# EAGLE schematic v1-1-0b (EAGLE 9.6.2)
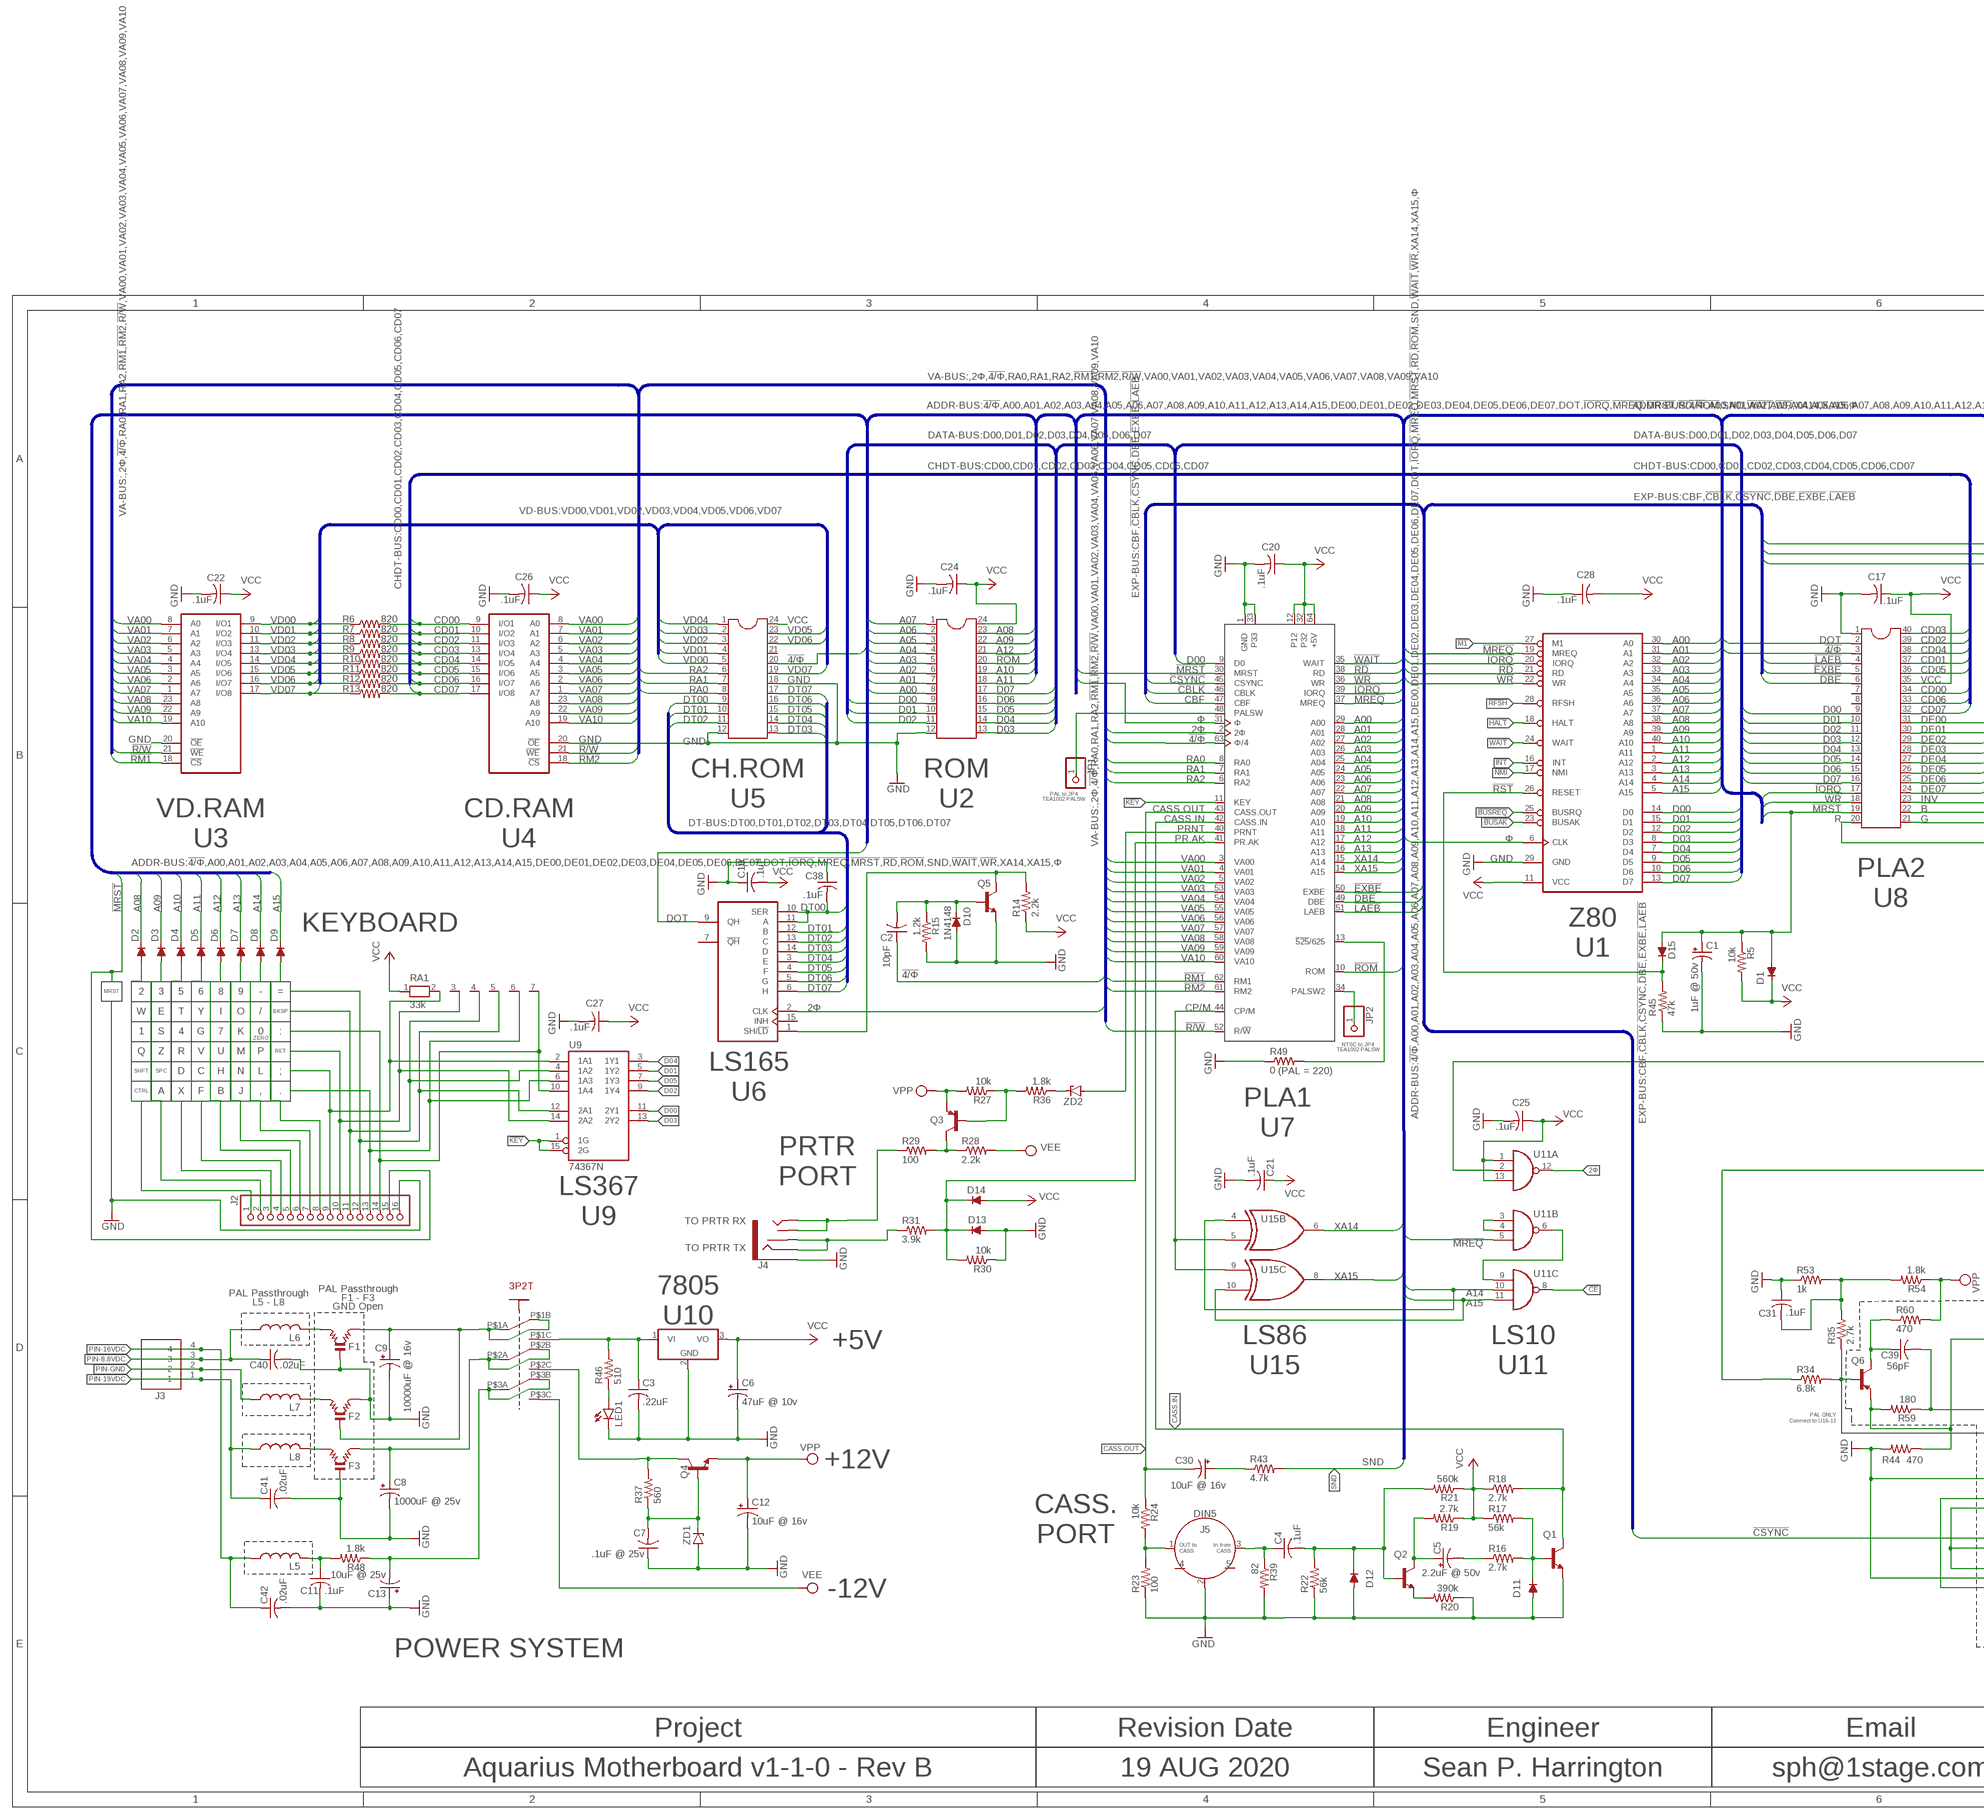
[diagram p0: schematic, sheet 1, part 1 of 2]
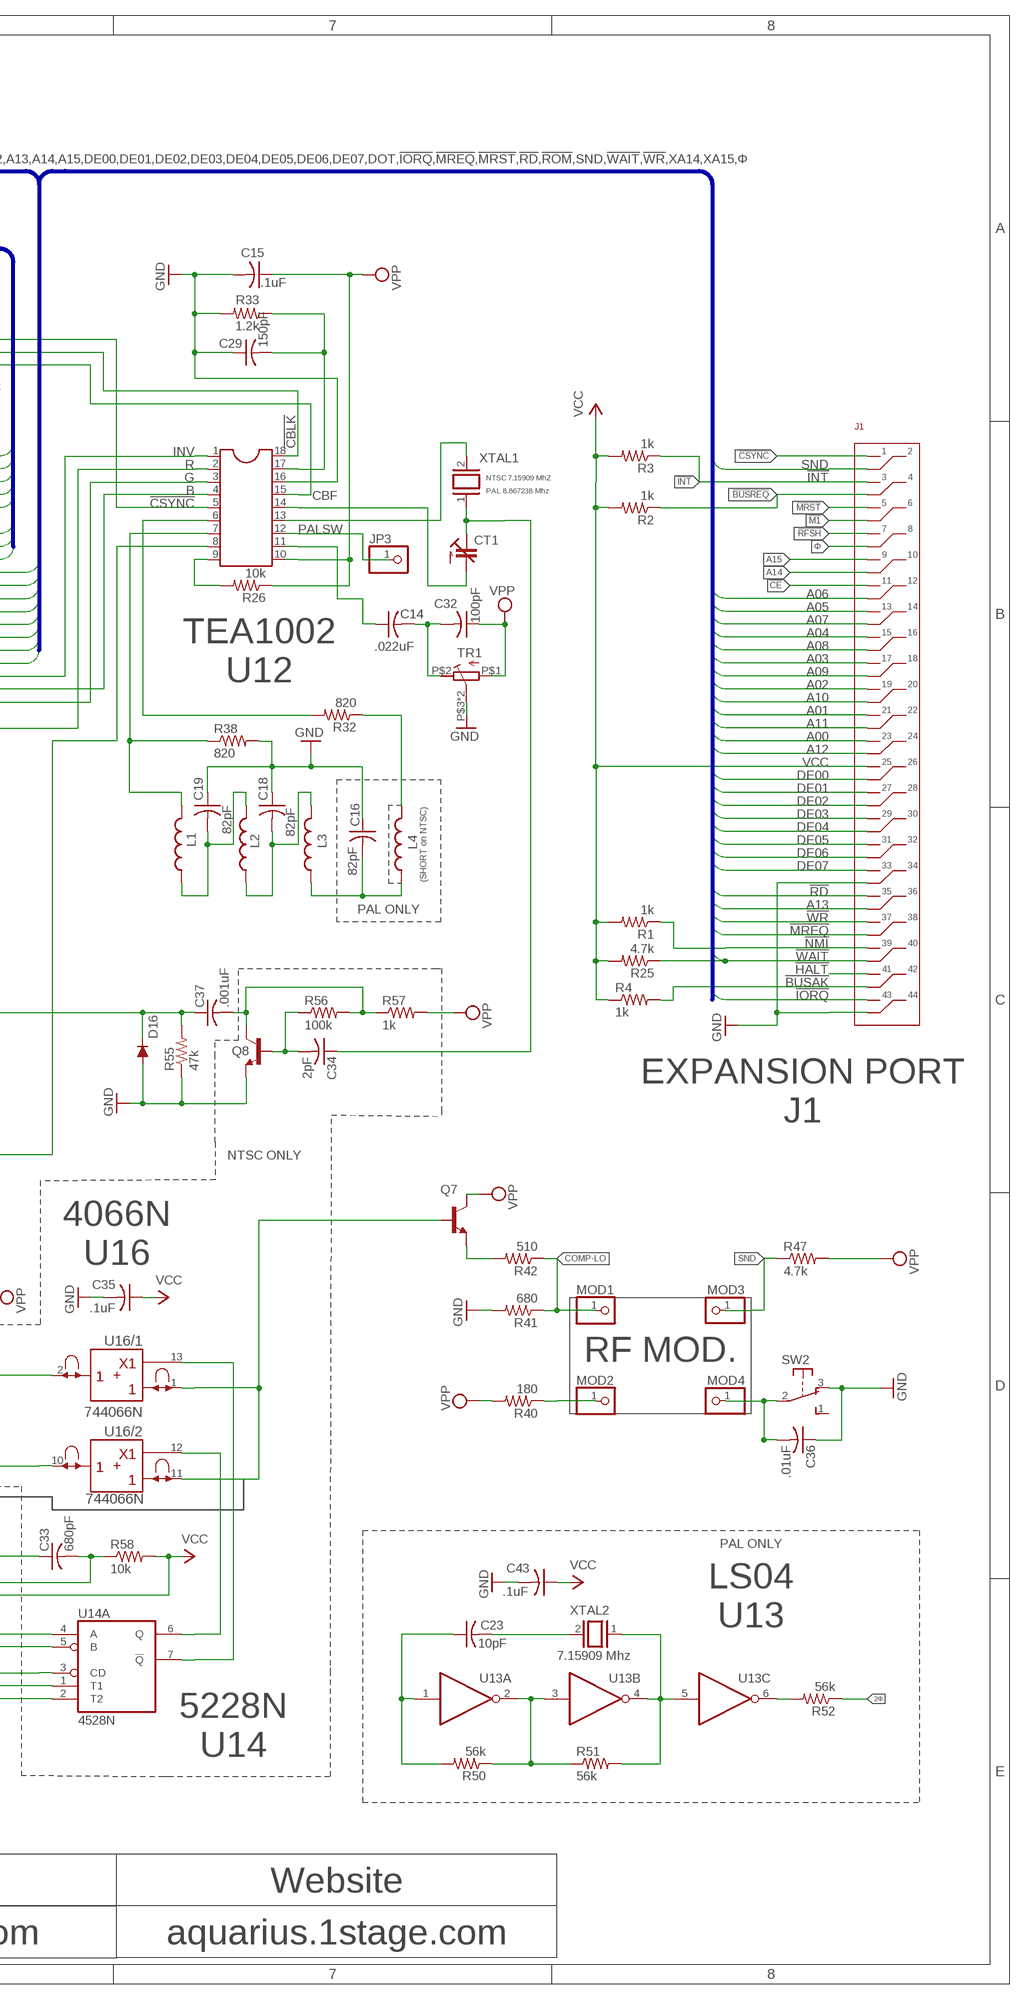
[diagram p1: schematic, sheet 1, part 2 of 2]

## Parts
C1  1uF @ 50v  CPOL-USE2.5-6  [E2,5-6]
C2  10pF  C-US050-024X044  [C050-024X044]
C3  .22uF  C-US050-025X090  [C050-025X090]
C4  .1uF  C-US050-025X090  [C050-025X090]
C5  2.2uF @ 50v  CPOL-USE2.5-6  [E2,5-6]
C6  47uF @ 10v  CPOL-USE2.5-6  [E2,5-6]
C7  .1uF @ 25v  C-US050-025X090  [C050-025X090]
C8  1000uF @ 25v  CPOL-USE7.5-16  [E7,5-16]
C9  10000uF @ 16v  CPOL-USE45-18AXIAL  [E45-18]
C10  .1uF  C-US050-025X090  [C050-025X090]
C11  .1uF  C-US050-025X090  [C050-025X090]
C12  10uF @ 16v  CPOL-USE2.5-6  [E2,5-6]
C13  10uF @ 25v  CPOL-USE2.5-6  [E2,5-6]
C14  .022uF  C-US050-024X044  [C050-024X044]
C15  .1uF  C-US050-025X090  [C050-025X090]
C16  82pF  C-US050-024X044  [C050-024X044]
C17  .1uF  C-US050-025X090  [C050-025X090]
C18  82pF  C-US050-024X044  [C050-024X044]
C19  82pF  C-US050-024X044  [C050-024X044]
C20  .1uF  C-US050-025X090  [C050-025X090]
C21  .1uF  C-US050-025X090  [C050-025X090]
C22  .1uF  C-US050-025X085  [C050-025X085]
C23  10pF  C-US050-024X044  [C050-024X044]
C24  .1uF  C-US050-025X090  [C050-025X090]
C25  .1uF  C-US050-025X090  [C050-025X090]
C26  .1uF  C-US050-025X085  [C050-025X085]
C27  .1uF  C-US050-025X090  [C050-025X090]
C28  .1uF  C-US050-025X090  [C050-025X090]
C29  150pF  C-US050-024X044  [C050-024X044]
C30  10uF @ 16v  CPOL-USE2.5-6  [E2,5-6]
C31  .1uF  C-US050-024X044  [C050-024X044]
C32  100pF  C-US025-024X044  [C025-024X044]
C33  680pF  C-US050-024X044  [C050-024X044]
C34  2pF  C-US025-024X044  [C025-024X044]
C35  .1uF  C-US050-025X090  [C050-025X090]
C36  .01uF  C-US050-024X044  [C050-024X044]
C37  .001uF  C-US025-030X050  [C025-030X050]
C38  .1uF  C-US050-025X085  [C050-025X085]
C39  56pF  C-US050-024X044  [C050-024X044]
C40  .02uF  C-US050-025X090  [C050-025X090]
C41  .02uF  C-US050-025X090  [C050-025X090]
C42  .02uF  C-US050-025X090  [C050-025X090]
C43  .1uF  C-US050-025X090  [C050-025X090]
CT1  C-TRIMM808  [CTRIM808-BC]
D1  1N4148  [DO35-10]
D2  1N4148H  1N4148-12  [DO35-12]
D3  1N4148H  1N4148-12  [DO35-12]
D4  1N4148H  1N4148-12  [DO35-12]
D5  1N4148H  1N4148-12  [DO35-12]
D6  1N4148H  1N4148-12  [DO35-12]
D7  1N4148H  1N4148-12  [DO35-12]
D8  1N4148H  1N4148-12  [DO35-12]
D9  1N4148H  1N4148-12  [DO35-12]
D10  1N4148  [DO35-10]
D11  1N4148  [DO35-10]
D12  1N4148  [DO35-10]
D13  1N4148  [DO35-10]
D14  1N4148  [DO35-10]
D15  1N4148  [DO35-10]
D16  1N4148  [DO35-10]
F1  LCL  [LCL]
F2  LCL  [LCL]
F3  LCL  [LCL]
J1  CR22A-44D-2.54DSA(70)  [CR22A-44D-2.54DSA(70)]
J2  PINHD-1X16  [1X16]
J3  26-60-4040  [SHDR4W155P0X396_1X4_1570X1001X]
J4  AUDIO_JACK_3.5MM_PTH  [AUDIO-JACK]
J5  DIN5  [DIN5-RA-PTH]
JP1  PINHD-1X1  [1X01]
JP2  PINHD-1X1  [1X01]
JP3  PINHD-1X1  [1X01]
L1  L-USTFI0305  [TFI0305]
L2  L-USTFI0305  [TFI0305]
L3  L-USTFI0305  [TFI0305]
L4  L-USTFI0305  [TFI0305]
L5  L-USTFI0305  [TFI0305]
L6  L-USTFI0305  [TFI0305]
L7  L-USTFI0305  [TFI0305]
L8  L-USTFI0305  [TFI0305]
LED1  LED5MM  [LED5MM]
MOD1  PINHD-1X1  [1X01]
MOD2  PINHD-1X1  [1X01]
MOD3  PINHD-1X1  [1X01]
MOD4  PINHD-1X1  [1X01]
Q1  -NPN-TO92-E1  [TO92-E1]
Q2  -NPN-TO92-E1  [TO92-E1]
Q3  -PNP-TO92-E1  [TO92-E1]
Q4  -NPN-TO220V  [TO220V]
Q5  -NPN-TO92-E1  [TO92-E1]
Q6  -PNP-TO92-E1  [TO92-E1]
Q7  -NPN-TO92-E1  [TO92-E1]
Q8  -NPN-TO92-E1  [TO92-E1]
R1  1k  R-US_0207/10  [0207/10]
R2  1k  R-US_0207/10  [0207/10]
R3  1k  R-US_0207/10  [0207/10]
R4  1k  R-US_0207/10  [0207/10]
R5  10k  R-US_0207/10  [0207/10]
R6  820  R-US_0207/10  [0207/10]
R7  820  R-US_0207/10  [0207/10]
R8  820  R-US_0207/10  [0207/10]
R9  820  R-US_0207/10  [0207/10]
R10  820  R-US_0207/10  [0207/10]
R11  820  R-US_0207/10  [0207/10]
R12  820  R-US_0207/10  [0207/10]
R13  820  R-US_0207/10  [0207/10]
R14  2.2k  R-US_0207/10  [0207/10]
R15  1.2k  R-US_0207/10  [0207/10]
R16  2.7k  R-US_0207/10  [0207/10]
R17  56k  R-US_0207/10  [0207/10]
R18  2.7k  R-US_0207/10  [0207/10]
R19  2.7k  R-US_0207/10  [0207/10]
R20  390k  R-US_0207/10  [0207/10]
R21  560k  R-US_0207/10  [0207/10]
R22  56k  R-US_0207/10  [0207/10]
R23  100  R-US_0207/10  [0207/10]
R24  10k  R-US_0207/10  [0207/10]
R25  4.7k  R-US_0207/10  [0207/10]
R26  10k  R-US_0207/10  [0207/10]
R27  10k  R-US_0207/10  [0207/10]
R28  2.2k  R-US_0207/10  [0207/10]
R29  100  R-US_0207/10  [0207/10]
R30  10k  R-US_0207/10  [0207/10]
R31  3.9k  R-US_0207/10  [0207/10]
R32  820  R-US_0207/10  [0207/10]
R33  1.2k  R-US_0207/10  [0207/10]
R34  6.8k  R-US_0207/10  [0207/10]
R35  2.7k  R-US_0207/10  [0207/10]
R36  1.8k  R-US_0207/10  [0207/10]
R37  560  R-US_0207/10  [0207/10]
R38  820  R-US_0207/10  [0207/10]
R39  82  R-US_0207/10  [0207/10]
R40  180  R-US_0207/10  [0207/10]
R41  680  R-US_0207/10  [0207/10]
R42  510  R-US_0207/10  [0207/10]
R43  4.7k  R-US_0207/10  [0207/10]
R44  470  R-US_0207/10  [0207/10]
R45  47k  R-US_0207/10  [0207/10]
R46  510  R-US_0207/10  [0207/10]
R47  4.7k  R-US_0207/10  [0207/10]
R48  1.8k  R-US_0207/10  [0207/10]
R49  0  R-US_0207/7  [0207/7]
R50  56k  R-US_0207/10  [0207/10]
R51  56k  R-US_0207/10  [0207/10]
R52  56k  R-US_0207/10  [0207/10]
R53  1k  R-US_0207/10  [0207/10]
R54  1.8k  R-US_0207/10  [0207/10]
R55  47k  R-US_0207/10  [0207/10]
R56  100k  R-US_0207/10  [0207/10]
R57  1k  R-US_0207/10  [0207/10]
R58  10k  R-US_0207/10  [0207/10]
R59  180  R-US_0207/10  [0207/10]
R60  470  R-US_0207/10  [0207/10]
RA1  33k  RN06  [RN-7]
SW1  3PDT-AQ-SWITCH  [3PDT-AQ-SWITCH]
SW2  9077-1  [9077-1]
TR1  R-TRIMM10MM-DUAL  [10MM-DUAL]
U1  Z80CPU  [DIL40]
U2  DIL24-6  [DIL24-6]
U3  6116P  [DIL24-6]
U4  6116P  [DIL24-6]
U5  DIL24-6  [DIL24-6]
U6  74LS165N  [DIL16]
U7  HD61K202P-PLA1  [HD61K202P-PLA1]
U8  DIL40  [DIL40]
U9  74367N  [DIL16]
U10  7805  7805TV  [TO220V]
U11  74LS10N  [DIL14]
U12  DIL18  [DIL18]
U13  74LS04N  [DIL14]
U14  4528N  [DIL16]
U15  74LS86N  [DIL14]
U16  744066N  [DIL14]
XTAL1  7.15909 MhZ  XTAL  [Q]
XTAL2  7.15909 Mhz  XTAL  [Q]
ZD1  ZENER-DIODEZD-10  [ZDIO-10]
ZD2  ZENER-DIODEZD-7.5  [ZDIO-7.5]

## Nets
2Φ: R52.1 U6.2(CLK) U7.2(2Φ) U11.12(A:O)
!4/Φ: C2.1 U5.20 U7.63(Φ/4) U8.3
!BUSAK: J1.P$42(X42) R4.2 U1.23(BUSAK)
!BUSREQ: J1.P$4(X4) R2.1 U1.25(BUSRQ)
!CBLK: U7.46(CBLK) U12.18
!CE: J1.P$11(X11) U11.8(C:O)
!CSYNC: J1.P$1(X1) U7.45(CSYNC) U12.5 U14.4(A:A)
!DBE: U7.49(DBE) U8.6
!EXBE: U7.50(EXBE) U8.5
!HALT: J1.P$41(X41) U1.18(HALT)
!INT: J1.P$3(X3) R3.1 U1.16(INT)
!IORQ: J1.P$43(X43) U1.20(IORQ) U7.39(IORQ) U8.17
!KEY: U7.11(KEY) U9.1(1G) U9.15(2G)
!LAEB: U7.51(LAEB) U8.4
!M1: J1.P$6(X6) U1.27(M1)
!MREQ: J1.P$38(X38) U1.19(MREQ) U7.37(MREQ) U11.5(B:I2)
!MRST: C1.+ D1.A D15.A J1.P$5(X5) J2.15 R5.1 U7.30(MRST) U8.19
!NMI: J1.P$39(X39) R1.1 U1.17(NMI)
!PL: Q5.1(C) R14.2 U6.1(SH/!LD)
!R/W: U3.21(!WE) U4.21(!WE) U7.52(R/!W)
!RD: J1.P$35(X35) U1.21(RD) U7.38(RD)
!RFSH: J1.P$7(X7) U1.28(RFSH)
!RM1: U3.18(!CS) U7.62(RM1)
!RM2: U4.18(!CS) U7.61(RM2)
!ROM: U2.20 U7.10(ROM)
!RST: D15.C R45.2 U1.26(RESET)
!WAIT: J1.P$40(X40) R25.1 U1.24(WAIT) U7.35(WAIT)
!WR: J1.P$37(X37) U1.22(WR) U7.36(WR) U8.18
A00: J1.P$23(X23) U1.30(A0) U2.8 U7.29(A00)
A01: J1.P$21(X21) U1.31(A1) U2.7 U7.28(A01)
A02: J1.P$19(X19) U1.32(A2) U2.6 U7.27(A02)
A03: J1.P$17(X17) U1.33(A3) U2.5 U7.26(A03)
A04: J1.P$15(X15) U1.34(A4) U2.4 U7.25(A04)
A05: J1.P$13(X13) U1.35(A5) U2.3 U7.24(A05)
A06: J1.P$12(X12) U1.36(A6) U2.2 U7.23(A06)
A07: J1.P$14(X14) U1.37(A7) U2.1 U7.22(A07)
A08: D2.C J1.P$16(X16) U1.38(A8) U2.23 U7.21(A08)
A09: D3.C J1.P$18(X18) U1.39(A9) U2.22 U7.20(A09)
A10: D4.C J1.P$20(X20) U1.40(A10) U2.19 U7.19(A10)
A11: D5.C J1.P$22(X22) U1.1(A11) U2.18 U7.18(A11)
A12: D6.C J1.P$24(X24) U1.2(A12) U2.21 U7.17(A12)
A13: D7.C J1.P$36(X36) U1.3(A13) U7.16(A13)
A14: D8.C J1.P$10(X10) U1.4(A14) U11.10(C:I1) U15.4(B:I0)
A15: D9.C J1.P$9(X9) U1.5(A15) U11.11(C:I2) U15.10(C:I1)
B: U8.22 U12.4
CASS.IN: Q1.1(C) R18.2 U7.42(CASS.IN)
CASS.OUT: C30.- R24.1 U7.43(CASS.OUT)
CBF: U7.47(CBF) U12.15
CD00: R6.2 U4.9(I/O1) U8.34
CD01: R7.2 U4.10(I/O2) U8.37
CD02: R8.2 U4.11(I/O3) U8.39
CD03: R9.2 U4.13(I/O4) U8.40
CD04: R10.2 U4.14(I/O5) U8.38
CD05: R11.2 U4.15(I/O6) U8.36
CD06: R12.2 U4.16(I/O7) U8.33
CD07: R13.2 U4.17(I/O8) U8.32
COMP-LO: MOD1.1 R41.1 R42.1
CP/M: U7.44(CP/M) U15.5(B:I1) U15.9(C:I0)
D00: U1.14(D0) U2.9 U7.9(D0) U8.9 U9.11(2Y1)
D01: U1.15(D1) U2.10 U8.10 U9.5(1Y2)
D02: U1.12(D2) U2.11 U8.11 U9.9(1Y4)
D03: U1.8(D3) U2.13 U8.12 U9.13(2Y2)
D04: U1.7(D4) U2.14 U8.13 U9.3(1Y1)
D05: U1.9(D5) U2.15 U8.14 U9.7(1Y3)
D06: U1.10(D6) U2.16 U8.15
D07: U1.13(D7) U2.17 U8.16
DE00: J1.P$26(X26) U8.31
DE01: J1.P$27(X27) U8.30
DE02: J1.P$28(X28) U8.29
DE03: J1.P$29(X29) U8.28
DE04: J1.P$30(X30) U8.27
DE05: J1.P$31(X31) U8.26
DE06: J1.P$32(X32) U8.25
DE07: J1.P$33(X33) U8.24
DOT: U6.9(QH) U8.2
DT00: C38.2 U5.9 U6.10(SER) U6.11(A)
DT01: U5.10 U6.12(B)
DT02: U5.11 U6.13(C)
DT03: U5.13 U6.14(D)
DT04: U5.14 U6.3(E)
DT05: U5.15 U6.4(F)
DT06: U5.16 U6.5(G)
DT07: U5.17 U6.6(H)
G: U8.21 U12.3
GND: C1.- C3.2 C6.- C7.1 C8.- C9.- C10.1 C11.2 C12.- C13.+ C15.2 C16.1 C17.2 C18.1 C19.1 C20.2 C21.2 C22.2 C24.2 C25.2 C26.2 C27.2 C28.1 C29.1 C31.1 C33.1 C35.2 C36.1 C38.1 C40.2 C41.2 C42.2 C43.2 D10.A D11.A D12.A D13.A D16.A F1.0(GND) F2.2 F3.0(GND) J1.P$34(X34) J1.P$44(X44) J2.16 J4.SLEEVE J5.2 LED1.K(C) Q1.3(E) Q5.3(E) Q8.3(E) R15.2 R20.1 R22.1 R23.1 R30.1 R33.2 R38.2 R39.2 R41.2 R44.2 R45.1 R49.1 R53.1 R55.1 SW2.3(O) TR1.P$3(S) TR1.P$4(S) U1.29(GND) U2.12 U3.20(!OE) U4.20(!OE) U5.12 U5.18 U7.1(GND) U7.33 U8.1 U10.2(GND) U12.16 U14.1(A:T1) ZD1.A
INV: U8.23 U12.1
KH01: D2.A J2.1
KH02: D3.A J2.2
KH03: D4.A J2.3
KH04: D5.A J2.4
KH05: D6.A J2.5
KH06: D7.A J2.6
KH07: D8.A J2.7
KH08: D9.A J2.8
KH09: J2.9 RA1.2 U9.2(1A1)
KH10: J2.10 RA1.3 U9.14(2A2)
KH11: J2.11 RA1.4 U9.4(1A2)
KH12: J2.12 RA1.5 U9.12(2A1)
KH13: J2.13 RA1.6 U9.6(1A3)
KH14: J2.14 RA1.7 U9.10(1A4)
N$12: R49.2 U7.13(!525!/625)
N$18: U11.3(B:I0) U11.4(B:I1)
N$19: JP2.1 U7.34(PALSW2)
N$21: U11.6(B:O) U11.9(C:I0)
N$22: C29.2 R33.1 U12.17
N$24: C5.+ Q2.1(C) R19.2
N$25: C4.2 D12.C Q2.2(B) R21.2 R22.2
N$26: Q2.3(E) R20.2
N$31: C9.+ F1.2 F2.0(GND) SW1.P$1A SW1.P$1B
N$37: C13.- R48.1 SW1.P$3A SW1.P$3B
N$45: J4.TIP J4.TSH R29.1
N$50: Q6.2(B) R34.2 R35.1
N$56: C3.1 R46.2 SW1.P$1C U10.1(VI)
N$57: Q4.2(C) R37.2 SW1.P$2C
N$63: C16.2 L3.1 L4.1
N$66: C19.2 L1.1 L2.2
N$67: C2.2 D10.C Q5.2(B) R15.1
N$68: F3.1 L8.2
N$69: R26.2 U12.9
N$70: C31.2 R35.2 R53.2 R54.2
N$71: C18.2 L2.1 L3.2
N$72: Q3.1(C) R28.1 R29.2
N$73: L4.2 R32.1
N$74: C34.1 CT1.1(E) XTAL1.1
N$75: CT1.2(A) U12.14
N$80: R32.2 U12.6
N$81: L1.2 R38.1 U12.7
N$82: U12.13 XTAL1.2
N$84: U14.6(A:Q) U16.12(/2:C)
N$104: J5.1 R23.2 R24.2
N$105: Q7.3(E) R42.2
N$109: C30.+ R43.1
N$110: C14.1 U12.11
N$111: Q3.2(B) R27.1 R36.2
N$113: R34.1 U12.8
N$114: C36.2 MOD4.1 SW2.2(P)
N$115: C4.1 J5.3 R39.1
N$118: C37.1 D16.C R55.2 U11.2(A:I1)
N$121: Q6.3(E) R44.1 R59.2 U16.2(/1:B)
N$122: JP1.1 U7.48(PALSW)
N$123: C33.2 R58.1 U14.2(A:T2)
N$131: C37.2 Q8.1(C) R56.2 R57.1
N$139: Q7.2(B) U16.1(/1:A) U16.11(/2:A)
N$153: LED1.A R46.1
N$155: R52.2 U13.6(C:O)
N$169: C7.2 Q4.1(B) R37.1 ZD1.C
N$175: D11.C Q1.2(B) R16.2 R17.2
N$180: R36.1 ZD2.C
N$181: C39.1 Q6.1(C) R60.1
N$196: J4.RING J4.RSH R31.1
N$197: U14.7(A:!Q) U16.13(/1:C)
N$199: R50.1 R51.1 U13.2(A:O) U13.3(B:I)
N$200: C23.1 R50.2 U13.1(A:I)
N$203: C39.2 R59.1 U16.10(/2:B)
N$204: R51.2 U13.4(B:O) U13.5(C:I) XTAL2.1
N$208: C23.2 XTAL2.2
N$211: F2.1 L7.2
N$590: C34.2 Q8.2(B) R56.1
N$620: C8.+ F3.2 SW1.P$2A SW1.P$2B
N$641: F1.1 L6.2
N$651: C11.1 L5.2 R48.2
N$680: MOD2.1 R40.1
N$691: C14.2 C32.2 TR1.P$2(E)
N$767: C5.- R16.1
PALSW: JP3.1 U12.12
PIN-8.8VDC: C40.1 J3.3 L6.1
PIN-16VDC: C42.1 J3.4 L5.1
PIN-19VDC: C41.1 J3.1 L8.1
PIN-GND: J3.2 L7.1
PR.AK: D13.C D14.C R30.2 R31.2 U7.41(PR.AK)
PRNT: U7.40(PRNT) ZD2.A
R: U8.20 U12.2
RA0: U5.8 U7.8(RA0)
RA1: U5.7 U7.7(RA1)
RA2: U5.6 U7.6(RA2)
SND: J1.P$2(X2) MOD3.1 R43.2 R47.1
VA00: U3.8(A0) U4.8(A0) U7.3(VA00)
VA01: U3.7(A1) U4.7(A1) U7.4(VA01)
VA02: U3.6(A2) U4.6(A2) U7.5(VA02)
VA03: U3.5(A3) U4.5(A3) U7.53(VA03)
VA04: U3.4(A4) U4.4(A4) U7.54(VA04)
VA05: U3.3(A5) U4.3(A5) U7.55(VA05)
VA06: U3.2(A6) U4.2(A6) U7.56(VA06)
VA07: U3.1(A7) U4.1(A7) U7.57(VA07)
VA08: U3.23(A8) U4.23(A8) U7.58(VA08)
VA09: U3.22(A9) U4.22(A9) U7.59(VA09)
VA10: U3.19(A10) U4.19(A10) U7.60(VA10)
VCC: C6.+ C10.2 C17.1 C20.1 C21.1 C22.1 C24.1 C25.1 C26.1 C27.1 C28.2 C35.1 C43.1 D1.C D14.A J1.P$25(X25) R1.2 R2.2 R3.2 R4.1 R5.2 R14.1 R17.1 R18.1 R19.1 R21.1 R25.2 R58.2 RA1.1 U1.11(VCC) U2.24 U5.24 U7.12 U7.32 U7.64(+5V) U8.35 U10.3(VO) U11.1(A:I0) U11.13(A:I2) U14.3(A:CD) U14.5(A:B)
VD00: R6.1 U3.9(I/O1) U5.5
VD01: R7.1 U3.10(I/O2) U5.4
VD02: R8.1 U3.11(I/O3) U5.3
VD03: R9.1 U3.13(I/O4) U5.2
VD04: R10.1 U3.14(I/O5) U5.1
VD05: R11.1 U3.15(I/O6) U5.23
VD06: R12.1 U3.16(I/O7) U5.22
VD07: R13.1 U3.17(I/O8) U5.19
VEE: R28.2 SW1.P$3C
VPP: C12.+ C15.1 C32.1 Q3.3(E) Q4.3(E) Q7.1(C) R26.1 R27.2 R40.2 R47.2 R54.1 R57.2 R60.2 TR1.P$1(A) U12.10
XA14: U7.15(A14) U15.6(B:O)
XA15: U7.14(A15) U15.8(C:O)
Φ: J1.P$8(X8) U1.6(CLK) U7.31(Φ)
Unconnected: J5.4 J5.5 SW2.1(S) U5.21 U6.7(!QH) U6.15(INH) U8.7 U8.8 U13.8(D:O) U13.9(D:I) U13.10(E:O) U13.11(E:I) U13.12(F:O) U13.13(F:I) U14.9(B:!Q) U14.10(B:Q) U14.11(B:B) U14.12(B:A) U14.13(B:CD) U14.14(B:T2) U14.15(B:T1) U15.1(A:I0) U15.2(A:I1) U15.3(A:O) U15.11(D:O) U15.12(D:I0) U15.13(D:I1) U16.3(/3:B) U16.4(/3:A) U16.5(/3:C) U16.6(/4:C) U16.8(/4:A) U16.9(/4:B)

## Buses
ADDR-BUS:!4/Φ,A00,A01,A02,A03,A04,A05,A06,A07,A08,A09,A10,A11,A12,A13,A14,A15,DE00,DE01,DE02,DE03,DE04,DE05,DE06,DE07,DOT,!IORQ,!MREQ,!MRST,!RD,!ROM,SND,!WAIT,!WR,XA14,XA15,Φ
DATA-BUS:D00,D01,D02,D03,D04,D05,D06,D07
CHDT-BUS:CD00,CD01,CD02,CD03,CD04,CD05,CD06,CD07
EXP-BUS:CBF,!CBLK,!CSYNC,!DBE,!EXBE,!LAEB
VA-BUS:!,2Φ,!4/Φ,RA0,RA1,RA2,!RM1,!RM2,!R/W,VA00,VA01,VA02,VA03,VA04,VA05,VA06,VA07,VA08,VA09,VA10
VD-BUS:VD00,VD01,VD02,VD03,VD04,VD05,VD06,VD07
DT-BUS:DT00,DT01,DT02,DT03,DT04,DT05,DT06,DT07

## Notes on the sheet
- NTSC
- PAL 8.867238 Mhz
- CH.ROM
  U5
- ROM
  U2
- TEA1002
  U12
- PAL to JP4
  TEA1002 PALSW
- VD.RAM
  U3
- CD.RAM
  U4
- PLA2
  U8
- KEYBOARD
- Z80
  U1
- (SHORT on NTSC)
- PAL ONLY
- MRST | 2 | 3 | 5 | 6 | 8 | 9 | - | =
- W | E | T | Y | I | O | / | BKSP
- 1 | S | 4 | G | 7 | K | 0 | :
- ZERO
- NTSC to JP4
  TEA1002 PALSW
- Q | Z | R | V | U | M | P | RET
- SHFT | SPC | D | C | H | N | L | ; | (PAL = 220)
- LS165
  U6
- CTRL | A | X | F | B | J | , | .
- PLA1
  U7
- EXPANSION PORT
  J1
- PRTR
  PORT
- NTSC ONLY
- LS367
  U9
- TO PRTR RX
- 4066N
  U16
- TO PRTR TX
- PAL Passthrough
  L5 - L8
- PAL Passthrough
  F1 - F3
  GND Open
- 7805
  U10
- RF MOD.
- +5V
- LS86
  U15
- LS10
  U11
- PAL ONLY
  Connect to U16-11
- +12V
- PAL ONLY
- LS04
  U13
- CASS.
  PORT
- OUT to
  CASS
- In from
  CASS
- -12V
- 5228N
  U14
- POWER SYSTEM
- Project | Revision Date | Engineer | Email | Website
- Aquarius Motherboard v1-1-0 - Rev B | 19 AUG 2020 | Sean P. Harrington | sph@1stage.com | aquarius.1stage.com

## Power pins joined to a net without a drawn wire
GND: U3.12(GND) U4.12(GND) U6.8(GND) U9.8(GND) U11.7(P:GND) U13.7(P:GND) U14.8(P:VSS) U15.7(P:GND) U16.7(/-UB:-UB)
VCC: U3.24(VCC) U4.24(VCC) U6.16(VCC) U9.16(VCC) U11.14(P:VCC) U13.14(P:VCC) U14.16(P:VDD) U15.14(P:VCC) U16.14(/+UB:+UB)

## Library data of the parts
C1 C5 C6 C8 C9 C12 C13 C30 = aq-rcl:CPOL-US: POLARIZED CAPACITOR, American symbol; SPICEPREFIX: C
C2 C14 C16 C18 C19 C23 C29 C31-C34 C36 C37 C39 = aq-rcl:C-US: CAPACITOR, American symbol; SPICEPREFIX: C
C3 C4 C7 C10 C11 C15 C17 C20-C22 C24-C28 C35 C38 C40-C43 = aq-rcl:C-US: CAPACITOR, American symbol
CT1 = aq-rcl:C-TRIMM: Trimm capacitor; SPICEPREFIX: C
D1-D16 = aq-diode:1N4148: DIODE high speed (Philips)
F1-F3 = murata-filter:LCL: FILTER; MPN: LCL; OC_FARNELL: 106331; OC_NEWARK: 06WX8509
J1 = con-hirose-sph:CR22A-44D-2.54DSA(70)
J2 = aquarius2:PINHD-1X16: PIN HEADER
J3 = 26-60-4040:26-60-4040: Molex KK 396 Series, Series Number 41791, 3.96mm Pitch 4 Way 1 Row Straight PCB Header, Through Hole Source: Datasheet; DESCRIPTION: Molex KK 396 Series, Series Number 41791, 3.96mm Pitch 4 Way 1 Row Straight PCB Header, Through Hole; HEIGHT: 15.01mm; MANUFACTURER_NAME: Molex; MANUFACTURER_PART_NUMBER: 26-60-4040; MOUSER_PART_NUMBER: 538-26-60-4040; MOUSER_PRICE-STOCK: https://www.mouser.co.uk/ProductDetail/Molex/26-60-4040?qs=tRPrwvvr%2FuiQpDQcO3P3Lw%3D%3D
J4 = SparkFun-Connectors:AUDIO_JACK_3.5MM: Audio Jack 3.5mm variants of PTH and SMT stereo audio jack with bypass switches. SparkFun Products: SparkFun SparkPunk Sound Kit <[https://www.sparkfun.com/products/11177]> - PTH MP3 Trigger <https://www.sparkfun.com/products/13720> -3.5mm SMD SparkFun PicoBoard <https://www.sparkfun.com/products/11888>- 2.5mm SMD; PROD_ID: CONN-08774; SF_ID: PRT-08032
J5 = SparkFun-Connectors:DIN5: DIN5 Connector - Female Right Angle (frequently used as a MIDI Jack connector) This type of connector and cable is frequently used for transmitting midi data (musical instrument digital interface). It is what you usually see on a keyboard or set of electronic drums. Learn more here. For more information on the pinout and electrical specifications of MIDI communications, please see the following resource: https://www.midi.org/specifications/item/midi-din-electrical-specification Here is the connector we sell at SparkFun: MIDI Connector - Female Right Angle (PRT-09536) Datasheet It is used on this SparkFun product: SparkFun MIDI Shield (DEV-12898); PROD_ID: CONN-09481
JP1-JP3 MOD1-MOD4 = aquarius2:PINHD-1X1: PIN HEADER
L1-L8 = aq-rcl:L-US: INDUCTOR, American symbol; SPICEPREFIX: L
LED1 = led:LED: LED OSRAM: - CHIPLED LG R971, LG N971, LY N971, LG Q971, LY Q971, LO R971, LY R971 LH N974, LH R974 LS Q976, LO Q976, LY Q976 LO Q996 - Hyper CHIPLED LW Q18S LB Q993, LB Q99A, LB R99A - SideLED LS A670, LO A670, LY A670, LG A670, LP A670 LB A673, LV A673, LT A673, LW A673 LH A674 LY A675 LS A676, LA A676, LO A676, LY A676, LW A676 LS A679, LY A679, LG A679 - Hyper Micro SIDELED® LS Y876, LA Y876, LO Y876, LY Y876 LT Y87S - SmartLED LW L88C, LW L88S LB L89C, LB L89S, LG L890 LS L89K, LO L89K, LY L89K LS L896, LA L896, LO L896, LY L896 - TOPLED LS T670, LO T670, LY T670, LG T670, LP T670 LSG T670, LSP T670, LSY T670, LOP T670, LYG T670 LG T671, LOG T671, LSG T671 LB T673, LV T673, LT T673, LW T673 LH T674 LS T676, LA T676, LO T676, LY T676, LB T676, LH T676, LSB T676, LW T676 LB T67C, LV T67C, LT T67C, LS T67K, LO T67K, LY T67K, LW E67C LS E67B, LA E67B, LO E67B, LY E67B, LB E67C, LV E67C, LT E67C LW T67C LS T679, LY T679, LG T679 LS T770, LO T770, LY T770, LG T770, LP T770 LB T773, LV T773, LT T773, LW T773 LH T774 LS E675, LA E675, LY E675, LS T675 LS T776, LA T776, LO T776, LY T776, LB T776 LHGB T686 LT T68C, LB T68C - Hyper Mini TOPLED® LB M676 - Mini TOPLED Santana® LG M470 LS M47K, LO M47K, LY M47K Source: http://www.osram.convergy.de LUXEON: - LUMILED® LXK2-PW12-R00, LXK2-PW12-S00, LXK2-PW14-U00, LXK2-PW14-V00 LXK2-PM12-R00, LXK2-PM12-S00, LXK2-PM14-U00 LXK2-PE12-Q00, LXK2-PE12-R00, LXK2-PE12-S00, LXK2-PE14-T00, LXK2-PE14-U00 LXK2-PB12-K00, LXK2-PB12-L00, LXK2-PB12-M00, LXK2-PB14-N00, LXK2-PB14-P00, LXK2-PB14-Q00 LXK2-PR12-L00, LXK2-PR12-M00, LXK2-PR14-Q00, LXK2-PR14-R00 LXK2-PD12-Q00, LXK2-PD12-R00, LXK2-PD12-S00 LXK2-PH12-R00, LXK2-PH12-S00 LXK2-PL12-P00, LXK2-PL12-Q00, LXK2-PL12-R00 Source: www.luxeon.com KINGBRIGHT: KA-3528ASYC Source: www.kingbright.com
Q1 Q2 Q5 Q7 Q8 = aq-transistor:*-NPN-: NPN Transistror BF959 corrected 2008.03.06
Q3 Q6 = aq-transistor:*-PNP-: PNP Transistror
Q4 = transistor:*-NPN-: NPN Transistror BF959 corrected 2008.03.06
R1-R60 = aq-rcl:R-US_: RESISTOR, American symbol; SPICEPREFIX: R
RA1 = aq-resistor-net:RN06: RESISTOR NETWORK; OC_FARNELL: unknown; OC_NEWARK: unknown
SW1 = aquarius:3PDT-AQ-SWITCH
SW2 = aq-switch-misc:9077-1: MARQUARDT SWITCH 9077.0100 Distributor: Buerklin
TR1 = aq-rcl:R-TRIMM: Trimm resistor
U1 = zilog:Z80CPU: Z80 FAMILY DEVICE
U2 U5 = ic-package:DIL24: Dual In Line
U3 U4 = memory-idt:6116P: MEMORY; OC_FARNELL: unknown; OC_NEWARK: unknown
U6 = 74xx-us:74*165: 8-bit parallel load SHIFT REGISTER
U7 = aquarius:HD61K202P-PLA1: HD61K202P-PLA1
U8 = ic-package:DIL40: Dual In Line
U9 = 74xx-us:74*367: Hex BUS DRIVER, 3-state
U10 = linear:78*: Positive VOLTAGE REGULATOR Source: http://cache.national.com/ds/LM/LM78L05.pdf http://www.fairchildsemi.com/ds/LM/LM7805.pdf
U11 = 74xx-eu:74*10: Triple 3-input NAND gate
U12 = ic-package:DIL18: Dual In Line / Socket
U13 = 74xx-us:74*04: Hex INVERTER
U14 = 45xx:4528: Dual monostable MULTIVIBRATOR
U15 = 74xx-us:74*86: Quad 2-input EXCLUSIV-OR (XOR) gate
U16 = 74ttl-din:74*4066: Quad analog SWITCH
XTAL1 XTAL2 = special:XTAL: CRYSTAL
ZD1 ZD2 = diode:ZENER-DIODE: Z-Diode